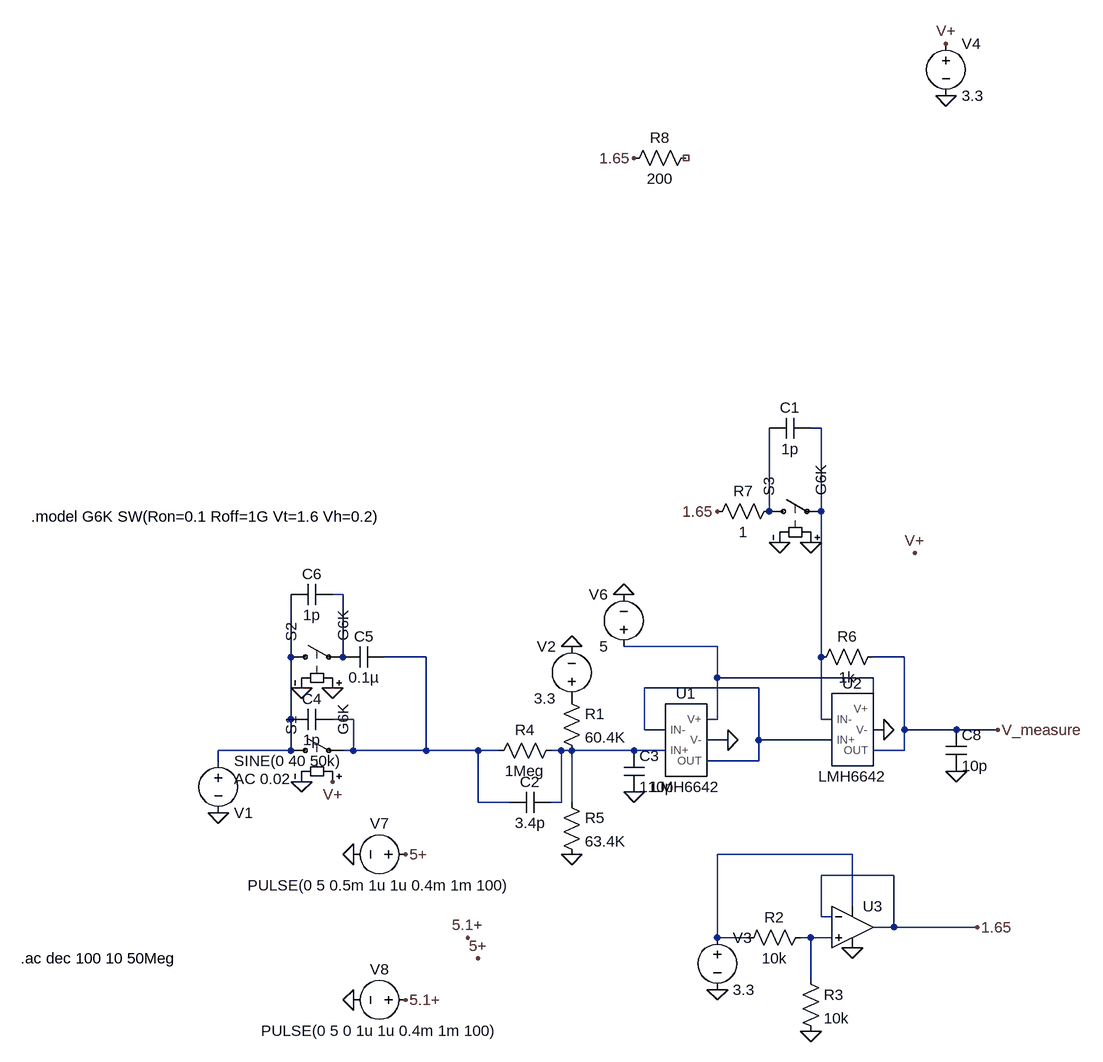
[diagram p0: schematic Analog Front End.asc]
Analog Front End.asc, the LTspice schematic file:
Version 4
SHEET 1 1348 680
WIRE 928 -336 912 -336
WIRE 848 -208 848 -336
WIRE 928 -208 928 -336
WIRE 192 -80 176 -80
WIRE 768 0 624 0
WIRE 112 16 112 -80
WIRE 192 16 192 -80
WIRE 320 16 256 16
WIRE 928 16 928 -208
WIRE 1056 16 1008 16
WIRE 768 48 768 0
WIRE 1008 48 768 48
WIRE 832 64 656 64
WIRE 1008 96 1008 48
WIRE 112 112 112 16
WIRE 208 112 176 112
WIRE 768 112 768 48
WIRE 768 112 752 112
WIRE 928 112 928 16
WIRE 944 112 928 112
WIRE 656 128 656 64
WIRE 688 128 656 128
WIRE 1024 128 1008 128
WIRE 1056 128 1056 16
WIRE 1136 128 1056 128
WIRE 1200 128 1136 128
WIRE 784 144 752 144
WIRE 832 144 832 64
WIRE 944 144 832 144
WIRE 112 160 112 112
WIRE 112 160 0 160
WIRE 208 160 208 112
WIRE 208 160 192 160
WIRE 320 160 320 16
WIRE 320 160 208 160
WIRE 400 160 320 160
WIRE 432 160 400 160
WIRE 528 160 512 160
WIRE 544 160 528 160
WIRE 640 160 544 160
WIRE 688 160 640 160
WIRE 1056 160 1056 128
WIRE 1056 160 1008 160
WIRE 0 176 0 160
WIRE 832 176 832 144
WIRE 832 176 752 176
WIRE 400 240 400 160
WIRE 448 240 400 240
WIRE 528 240 528 160
WIRE 528 240 512 240
WIRE 544 240 544 160
WIRE 976 320 768 320
WIRE 1040 352 928 352
WIRE 976 400 976 320
WIRE 928 416 928 352
WIRE 944 416 928 416
WIRE 1040 432 1040 352
WIRE 1040 432 1008 432
WIRE 1168 432 1040 432
WIRE 768 448 768 320
WIRE 816 448 768 448
WIRE 912 448 896 448
WIRE 944 448 912 448
WIRE 912 512 912 448
FLAG 544 0 0
FLAG 768 528 0
FLAG 912 592 0
FLAG 1168 432 1.65
FLAG 544 320 0
FLAG 976 464 0
FLAG 640 -752 1.65
FLAG 0 256 0
FLAG 1200 128 V_measure
FLAG 1120 -928 V+
FLAG 1120 -848 0
FLAG 640 224 0
FLAG 784 144 0
FLAG 1024 128 0
FLAG 624 -80 0
FLAG 288 320 5+
FLAG 208 320 0
FLAG 128 208 0
FLAG 400 480 5+
FLAG 128 64 0
FLAG 288 544 5.1+
FLAG 208 544 0
FLAG 384 448 5.1+
FLAG 1072 -144 V+
FLAG 864 -160 0
FLAG 768 -208 1.65
FLAG 176 208 V+
FLAG 176 64 0
FLAG 912 -160 0
FLAG 1136 192 0
DATAFLAG 304 544 ""
SYMBOL voltage 544 96 R180
WINDOW 0 24 96 Left 2
WINDOW 3 24 16 Left 2
WINDOW 123 0 0 Left 0
WINDOW 39 0 0 Left 0
SYMATTR InstName V2
SYMATTR Value 3.3
SYMBOL res 528 64 R0
SYMATTR InstName R1
SYMATTR Value 60.4K
SYMBOL voltage 768 432 R0
WINDOW 123 0 0 Left 0
WINDOW 39 0 0 Left 0
SYMATTR InstName V3
SYMATTR Value 3.3
SYMBOL res 912 432 R90
WINDOW 0 0 56 VBottom 2
WINDOW 3 32 56 VTop 2
SYMATTR InstName R2
SYMATTR Value 10k
SYMBOL res 896 496 R0
SYMATTR InstName R3
SYMATTR Value 10k
SYMBOL res 528 144 R90
WINDOW 0 0 56 VBottom 2
WINDOW 3 32 56 VTop 2
SYMATTR InstName R4
SYMATTR Value 1Meg
SYMBOL res 528 224 R0
SYMATTR InstName R5
SYMATTR Value 63.4K
SYMBOL res 1024 0 R90
WINDOW 0 0 56 VBottom 2
WINDOW 3 32 56 VTop 2
SYMATTR InstName R6
SYMATTR Value 1k
SYMBOL res 864 -224 R90
WINDOW 0 0 56 VBottom 2
WINDOW 3 32 56 VTop 2
SYMATTR InstName R7
SYMATTR Value 1
SYMBOL res 736 -768 R90
WINDOW 0 0 56 VBottom 2
WINDOW 3 32 56 VTop 2
SYMATTR InstName R8
SYMATTR Value 200
SYMBOL OpAmps\\UniversalOpAmp2 976 432 R0
SYMATTR InstName U3
SYMBOL voltage 1120 -944 R0
WINDOW 123 0 0 Left 0
WINDOW 39 0 0 Left 0
SYMATTR InstName V4
SYMATTR Value 3.3
SYMBOL voltage 0 160 R0
WINDOW 0 24 96 Left 2
WINDOW 3 24 16 Left 2
WINDOW 123 24 44 Left 2
WINDOW 39 0 0 Left 0
SYMATTR InstName V1
SYMATTR Value SINE(0 40 50k)
SYMATTR Value2 AC 0.02
SYMBOL cap 624 160 R0
SYMATTR InstName C3
SYMATTR Value 110p
SYMBOL cap 512 224 R90
WINDOW 0 0 32 VBottom 2
WINDOW 3 32 32 VTop 2
SYMATTR InstName C2
SYMATTR Value 3.4p
SYMBOL LMH6642 720 144 R0
SYMATTR InstName U1
SYMBOL LMH6642 976 128 R0
SYMATTR InstName U2
SYMBOL voltage 624 16 R180
WINDOW 0 24 96 Left 2
WINDOW 3 24 16 Left 2
WINDOW 123 0 0 Left 0
WINDOW 39 0 0 Left 0
SYMATTR InstName V6
SYMATTR Value 5
SYMBOL sw 96 160 R270
SYMATTR InstName S1
SYMATTR Value G6K
SYMBOL sw 96 16 R270
SYMATTR InstName S2
SYMATTR Value G6K
SYMBOL cap 256 0 R90
WINDOW 0 0 32 VBottom 2
WINDOW 3 32 32 VTop 2
SYMATTR InstName C5
SYMATTR Value 0.1µ
SYMBOL voltage 304 320 R90
WINDOW 0 -32 56 VBottom 2
WINDOW 3 32 56 VTop 2
WINDOW 123 0 0 Left 0
WINDOW 39 0 0 Left 0
SYMATTR InstName V7
SYMATTR Value PULSE(0 5 0.5m 1u 1u 0.4m 1m 100)
SYMBOL voltage 304 544 R90
WINDOW 0 -32 56 VBottom 2
WINDOW 3 32 56 VTop 2
WINDOW 123 0 0 Left 0
WINDOW 39 0 0 Left 0
SYMATTR InstName V8
SYMATTR Value PULSE(0 5 0 1u 1u 0.4m 1m 100)
SYMBOL cap 176 96 R90
WINDOW 0 0 32 VBottom 2
WINDOW 3 32 32 VTop 2
SYMATTR InstName C4
SYMATTR Value 1p
SYMBOL cap 176 -96 R90
WINDOW 0 0 32 VBottom 2
WINDOW 3 32 32 VTop 2
SYMATTR InstName C6
SYMATTR Value 1p
SYMBOL sw 832 -208 R270
SYMATTR InstName S3
SYMATTR Value G6K
SYMBOL cap 912 -352 R90
WINDOW 0 0 32 VBottom 2
WINDOW 3 32 32 VTop 2
SYMATTR InstName C1
SYMATTR Value 1p
SYMBOL cap 1120 128 R0
SYMATTR InstName C8
SYMATTR Value 10p
TEXT -288 -200 Left 2 !.model G6K SW(Ron=0.1 Roff=1G Vt=1.6 Vh=0.2)
TEXT -304 480 Left 2 !.ac dec 100 10 50Meg

The netlist it stands for:
* Analog Front End.asc
V2 P001 0 3.3
R1 P001 N008 60.4K
V3 N009 0 3.3
R2 N010 N009 10k
R3 N010 0 10k
R4 N008 N006 1Meg
R5 N008 0 63.4K
R6 V_measure N001 1k
R7 N002 1.65 1
R8 NC_01 1.65 200
XU3 N010 1.65 N009 0 1.65 level2 Avol=1Meg GBW=10Meg Slew=10Meg Ilimit=25m Rail=0 Vos=0 En=0 Enk=0 In=0 Ink=0 Rin=500Meg  ; pins In+ In- V+ V- OUT
V4 V+ 0 3.3
V1 N005 0 SINE(0 40 50k) AC 0.02
C3 N008 0 110p
C2 N008 N006 3.4p
XU1 N007 N008 N004 0 N007 LMH6642  ; pins IN- IN+ V+ V- OUT
XU2 N001 N007 N004 0 V_measure LMH6642  ; pins IN- IN+ V+ V- OUT
V6 N004 0 5
S1 N005 N006 V+ 0 G6K
S2 N005 N003 0 0 G6K
C5 N006 N003 0.1µ
V7 5+ 0 PULSE(0 5 0.5m 1u 1u 0.4m 1m 100)
V8 5.1+ 0 PULSE(0 5 0 1u 1u 0.4m 1m 100)
C4 N006 N005 1p
C6 N003 N005 1p
S3 N002 N001 0 0 G6K
C1 N001 N002 1p
C8 V_measure 0 10p
.model G6K SW(Ron=0.1 Roff=1G Vt=1.6 Vh=0.2)
.ac dec 100 10 50Meg
.lib UniversalOpAmp2.lib
.lib C:\Users\polus\OneDrive\Pulpit\Projekty\Oscyloskop\Symulacje\LMH6642.MOD
.backanno
.end